# Altium schematic sheet Sheet1.SchDoc
size A4
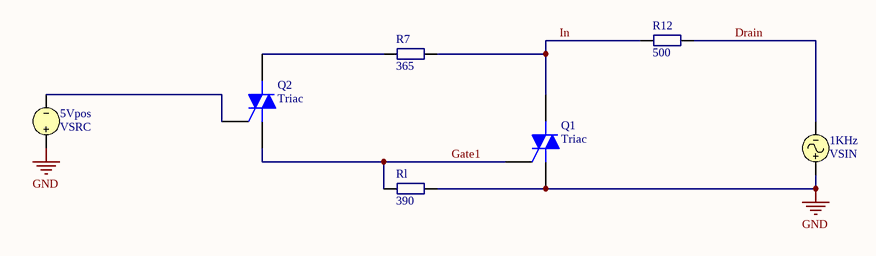
[diagram p0: Sheet1.SchDoc]

## Parts
1KHz  VSIN
5Vpos  VSRC
Q1  Triac  [369-03]
Q2  Triac  [369-03]
R7  365  [J1-0603]
R12  500  [J1-0603]
Rl  390  [J1-0603]

## Nets
GND: 1KHz.1 5Vpos.1 Q1.1(M1) Rl.1
Drain: 1KHz.2 R12.1
Gate1: Q1.3(G) Q2.1(M1) Rl.2
In: Q1.2(M2) R7.1 R12.2
Net5Vpos_2: 5Vpos.2 Q2.3(G)
NetQ2_2: Q2.2(M2) R7.2

## Library data of the parts
1KHz = VSIN: Sinusoidal Voltage Source; Note: PCB Footprint - Not required; Published: 8-Jun-2000; LatestRevisionDate: 15-Nov-2004; LatestRevisionNote: Corrected Netlist.; PackageReference: Not Applicable; Publisher: Altium Limited
5Vpos = VSRC: Voltage Source; Note: PCB Footprint - Not required; Value: +25; Published: 8-Jun-2000; LatestRevisionDate: 17-Jul-2002; LatestRevisionNote: Re-released for DXP Platform.; PackageReference: Not Applicable; Publisher: Altium Limited
Q1 Q2 = Triac: Silicon Bidirectional Triode Thyristor; Note: Pin 2 is electrically connected to Pin 4 (TAB); Published: 29-Sep-2000; LatestRevisionDate: 17-Jul-2002; LatestRevisionNote: Re-released for DXP Platform.; DatasheetVersion: 1999; PackageReference: 369-03; Publisher: Altium Limited; PackageDescription: TO, Thru-Hole, Vertical, Heatsink Mounted; 3 In-Line Leads; Pitch 2.28 mm; ComponentLink1Description: Manufacturer Link; ComponentLink1URL: http://www.motorola.com/
R7 R12 Rl = Res_SMD: Resistor; Published: 8-Jun-2000; LatestRevisionDate: 29-May-2009; LatestRevisionNote: IPC-7351 Footprint Added.; PackageReference: J1-0603; Publisher: Altium Limited; PackageDescription: Chip Resistor
  R7: Value: 365
  R12: Value: 500
  Rl: Value: 390